# EAGLE design Breakout-01 (EAGLE 6.2)
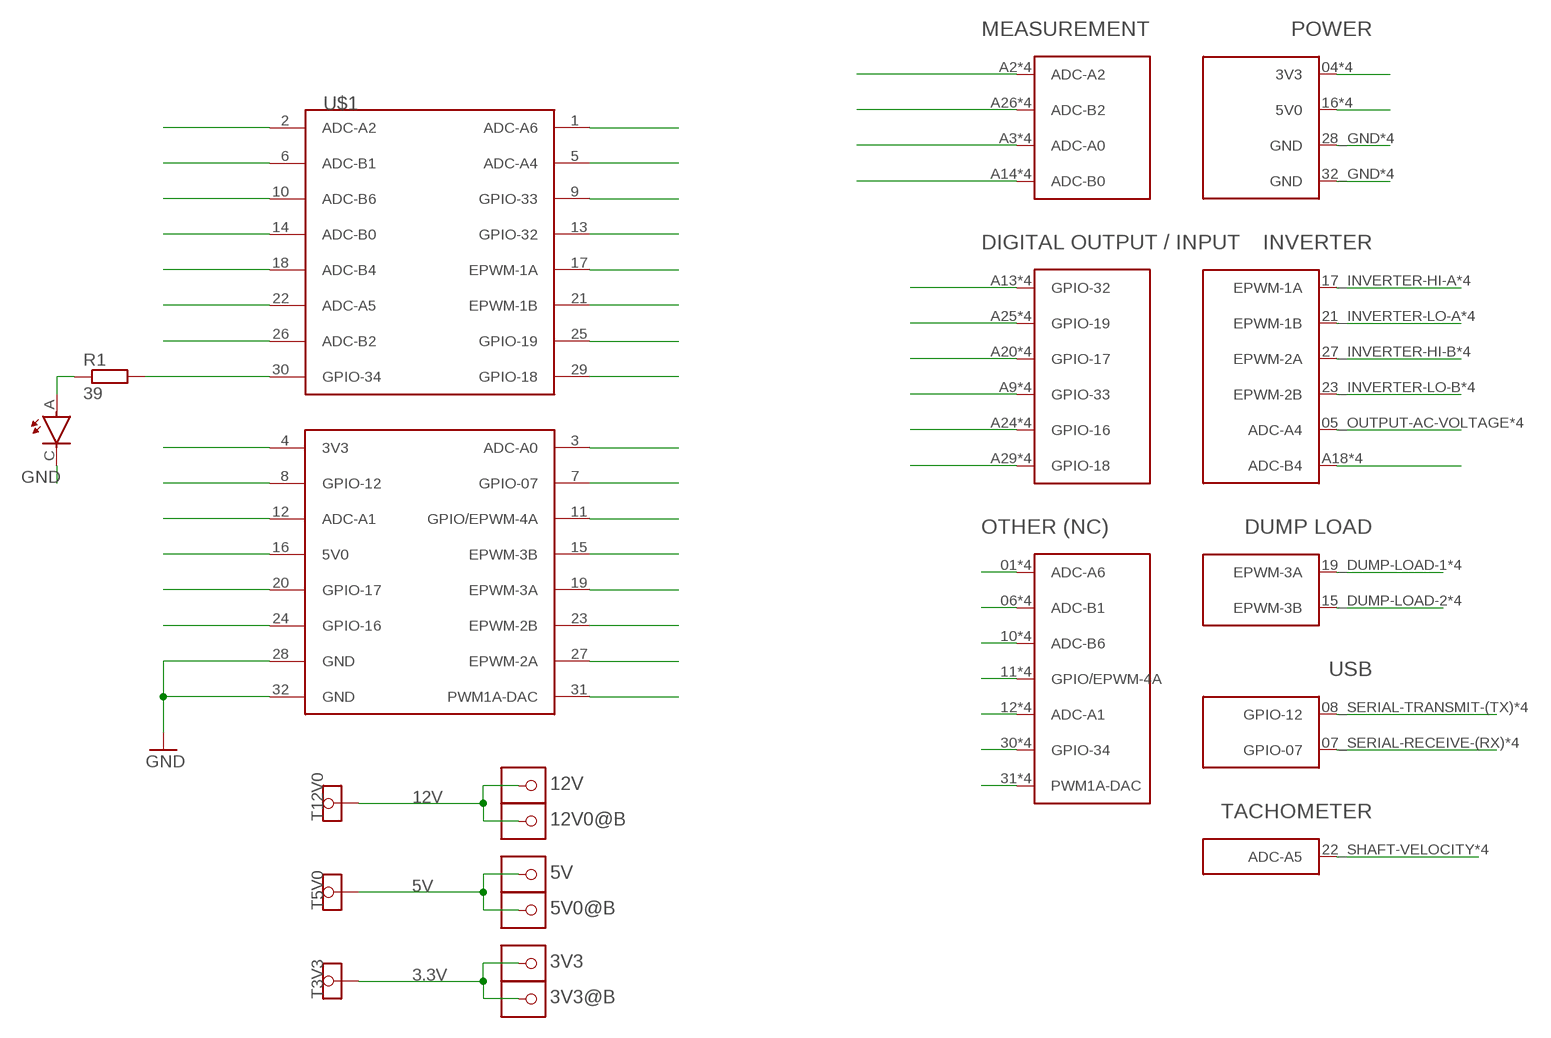
[diagram p0: schematic, sheet 1]

## Parts
3V3  1X1STACK  [1X1STACK]
3V3@B  1X1STACK  [1X1STACK]
5V  1X1STACK  [1X1STACK]
5V0@B  1X1STACK  [1X1STACK]
12V  1X1STACK  [1X1STACK]
12V0@B  1X1STACK  [1X1STACK]
GPIO34  PLCC2  [PLCC2]
R1  39  R-EU_R0805  [R0805]
T3V3  TESTPAD  [TESTPAD]
T5V0  TESTPAD  [TESTPAD]
T12V0  TESTPAD  [TESTPAD]
U$1  CONTROLLER_SOCKET  [CONTROLLER_SOCKET]
U$2  CONTROLLER_STACK  [CONTROLLER_STACK]

## Nets
3.3V: 3V3.P$2 3V3.P$5 3V3.P$58 3V3.P$65 3V3.PAD 3V3@B.P$2 3V3@B.P$5 3V3@B.P$58 3V3@B.P$65 3V3@B.PAD T3V3.TP
3V3: U$1.4(3V3) U$2.04(3V3) U$2.A4(3V3) U$2.B4(3V3) U$2.C4(3V3)
5V: 5V0@B.P$2 5V0@B.P$5 5V0@B.P$58 5V0@B.P$65 5V0@B.PAD 5V.P$2 5V.P$5 5V.P$58 5V.P$65 5V.PAD T5V0.TP
5V0: U$1.16(5V0) U$2.16(5V0) U$2.A16(5V0) U$2.B16(5V0) U$2.C16(5V0)
12V: 12V0@B.P$2 12V0@B.P$5 12V0@B.P$58 12V0@B.P$65 12V0@B.PAD 12V.P$2 12V.P$5 12V.P$58 12V.P$65 12V.PAD T12V0.TP
ADCA0: U$1.3(ADC-A0) U$2.A3(ADC-A0) U$2.B3(ADC-A0) U$2.C3(ADC-A0) U$2.INPUT-AC-VOLTAGE_03(ADC-A0)
ADCA1: U$1.12(ADC-A1) U$2.12(ADC-A1) U$2.A12(ADC-A1) U$2.B12(ADC-A1) U$2.C12(ADC-A1)
ADCA2: U$1.2(ADC-A2) U$2.A2(ADC-A2) U$2.B2(ADC-A2) U$2.C2(ADC-A2) U$2.DC-BRIDGE-CURRENT_02(ADC-A2)
ADCA4: U$1.5(ADC-A4) U$2.05_OUTPUT-AC-VOLTAGE(ADC-A4) U$2.A5(ADC-A4) U$2.B5(ADC-A4) U$2.C5(ADC-A4)
ADCA5: U$1.22(ADC-A5) U$2.22_SHAFT-VELOCITY(ADC-A5) U$2.A22(ADC-A5) U$2.B22(ADC-A5) U$2.C22(ADC-A5)
ADCA6: U$1.1(ADC-A6) U$2.01(ADC-A6) U$2.A1(ADC-A6) U$2.B1(ADC-A6) U$2.C1(ADC-A6)
ADCB0: U$1.14(ADC-B0) U$2.A14(ADC-B0) U$2.AC-INPUT-CURRENT_14(ADC-B0) U$2.B14(ADC-B0) U$2.C14(ADC-B0)
ADCB1: U$1.6(ADC-B1) U$2.06(ADC-B1) U$2.A6(ADC-B1) U$2.B6(ADC-B1) U$2.C6(ADC-B1)
ADCB2: U$1.26(ADC-B2) U$2.A26(ADC-B2) U$2.B26(ADC-B2) U$2.C26(ADC-B2) U$2.DC-BRIDGE-VOLTAGE_26(ADC-B2)
ADCB4: U$1.18(ADC-B4) U$2.A18(ADC-B4) U$2.AC-OUTPUT-CURRENT_18(ADC-B4) U$2.B18(ADC-B4) U$2.C18(ADC-B4)
ADCB6: U$1.10(ADC-B6) U$2.10(ADC-B6) U$2.A10(ADC-B6) U$2.B10(ADC-B6) U$2.C10(ADC-B6)
EPWM1A: U$1.17(EPWM-1A) U$2.17_INVERTER-HI-A(EPWM-1A) U$2.A17(EPWM-1A) U$2.B17(EPWM-1A) U$2.C17(EPWM-1A)
EPWM1B: U$1.21(EPWM-1B) U$2.21_INVERTER-LO-A(EPWM-1B) U$2.A21(EPWM-1B) U$2.B21(EPWM-1B) U$2.C21(EPWM-1B)
EPWM2A: U$1.27(EPWM-2A) U$2.27_INVERTER-HI-B(EPWM-2A) U$2.A27(EPWM-2A) U$2.B27(EPWM-2A) U$2.C27(EPWM-2A)
EPWM2B: U$1.23(EPWM-2B) U$2.23_INVERTER-LO-B(EPWM-2B) U$2.A23(EPWM-2B) U$2.B23(EPWM-2B) U$2.C23(EPWM-2B)
EPWM3A: U$1.19(EPWM-3A) U$2.19_DUMP-LOAD-1(EPWM-3A) U$2.A19(EPWM-3A) U$2.B19(EPWM-3A) U$2.C19(EPWM-3A)
EPWM3B: U$1.15(EPWM-3B) U$2.15_DUMP-LOAD-2(EPWM-3B) U$2.A15(EPWM-3B) U$2.B15(EPWM-3B) U$2.C15(EPWM-3B)
EPWM4A: U$1.11(GPIO/EPWM-4A) U$2.11(GPIO/EPWM-4A) U$2.A11(GPIO/EPWM-4A) U$2.B11(GPIO/EPWM-4A) U$2.C11(GPIO/EPWM-4A)
GND: GPIO34.C U$1.28(GND) U$1.32(GND) U$2.28_GND(GND) U$2.32_GND(GND) U$2.A28(GND) U$2.A32(GND) U$2.B28(GND) U$2.B32(GND) U$2.C28(GND) U$2.C32(GND)
GPIO07: U$1.7(GPIO-07) U$2.07_SERIAL-RECEIVE-(RX)(GPIO-07) U$2.A7(GPIO-07) U$2.B7(GPIO-07) U$2.C7(GPIO-07)
GPIO12: U$1.8(GPIO-12) U$2.08_SERIAL-TRANSMIT-(TX)(GPIO-12) U$2.A8(GPIO-12) U$2.B8(GPIO-12) U$2.C8(GPIO-12)
GPIO16: U$1.24(GPIO-16) U$2.A24(GPIO-16) U$2.B24(GPIO-16) U$2.C24(GPIO-16) U$2.DATA-IN_24(GPIO-16)
GPIO17: U$1.20(GPIO-17) U$2.A20(GPIO-17) U$2.B20(GPIO-17) U$2.C20(GPIO-17) U$2.DATA-OUT_20(GPIO-17)
GPIO18: U$1.29(GPIO-18) U$2.A29(GPIO-18) U$2.B29(GPIO-18) U$2.C29(GPIO-18) U$2.LOAD_29(GPIO-18)
GPIO19: U$1.25(GPIO-19) U$2.A25(GPIO-19) U$2.B25(GPIO-19) U$2.C25(GPIO-19) U$2.CLOCK-OUT-2_25(GPIO-19)
GPIO32: U$1.13(GPIO-32) U$2.A13(GPIO-32) U$2.B13(GPIO-32) U$2.C13(GPIO-32) U$2.CLOCK-OUT-1_13(GPIO-32)
GPIO33: U$1.9(GPIO-33) U$2.A9(GPIO-33) U$2.B9(GPIO-33) U$2.C9(GPIO-33) U$2.CLOCK_09(GPIO-33)
GPIO34: R1.2 U$1.30(GPIO-34) U$2.30(GPIO-34) U$2.A30(GPIO-34) U$2.B30(GPIO-34) U$2.C30(GPIO-34)
N$2: GPIO34.A R1.1
PWM1ADAC: U$1.31(PWM1A-DAC) U$2.31(PWM1A-DAC) U$2.A31(PWM1A-DAC) U$2.B31(PWM1A-DAC) U$2.C31(PWM1A-DAC)

## Library data of the parts
3V3 3V3@B 5V 5V0@B 12V 12V0@B = headers v6-2:1X1STACK
GPIO34 = PCB_ControlStack:PLCC2
R1 = resistor:R-EU_: RESISTOR, European symbol
T3V3 T5V0 T12V0 = PCB_ControlStack:TESTPAD
U$1 = PCB_ControlStack:CONTROLLER_SOCKET
U$2 = PCB_ControlStack:CONTROLLER_STACK

## Board
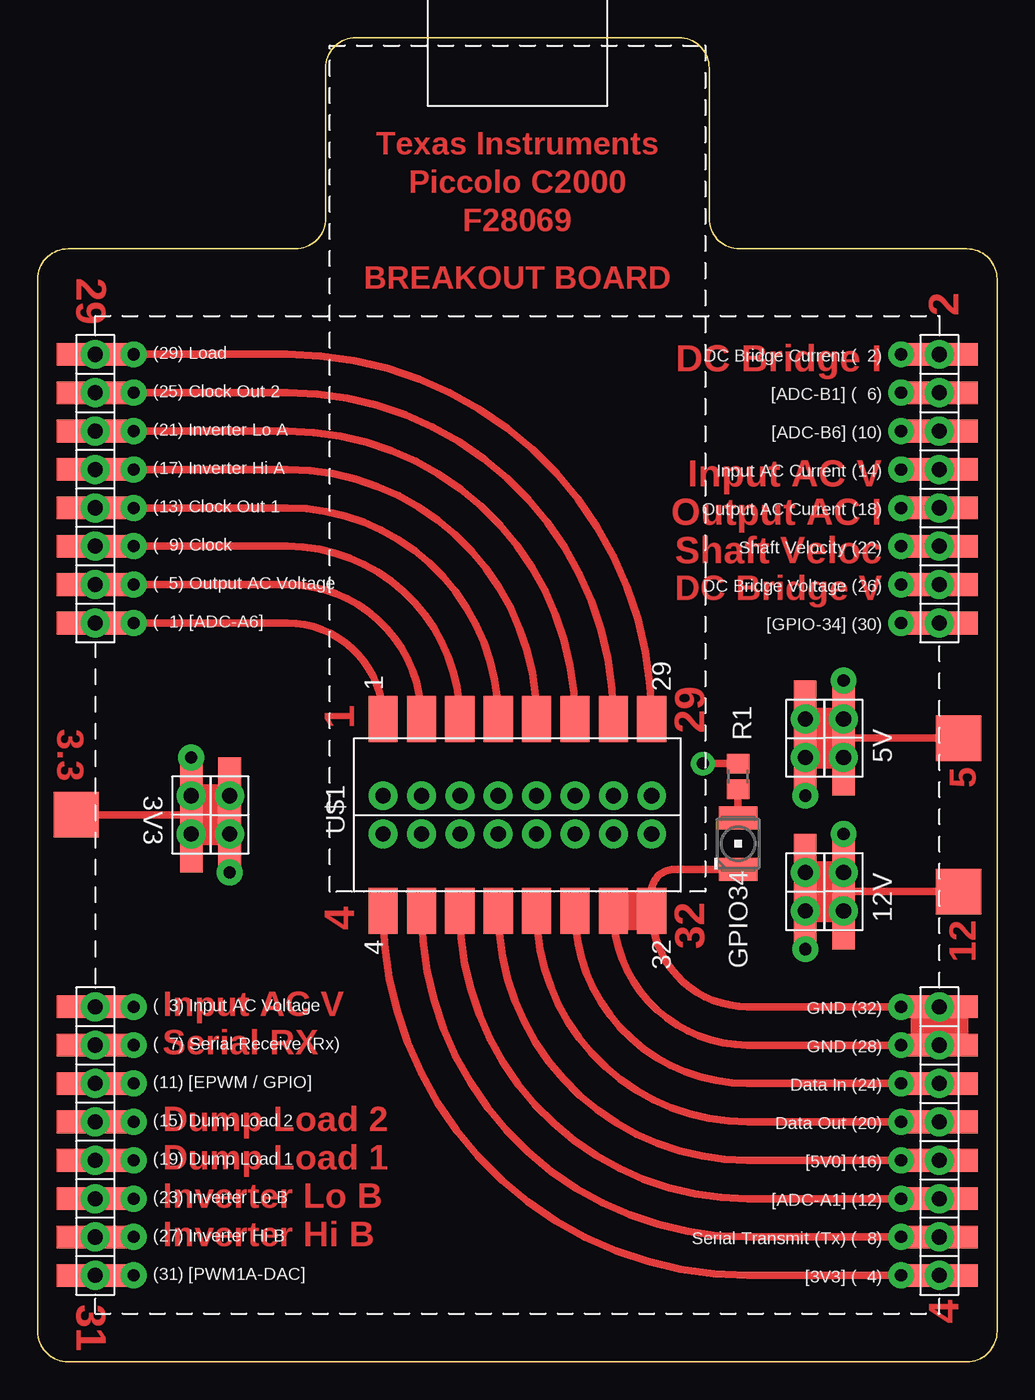
[diagram p1: board, top side]
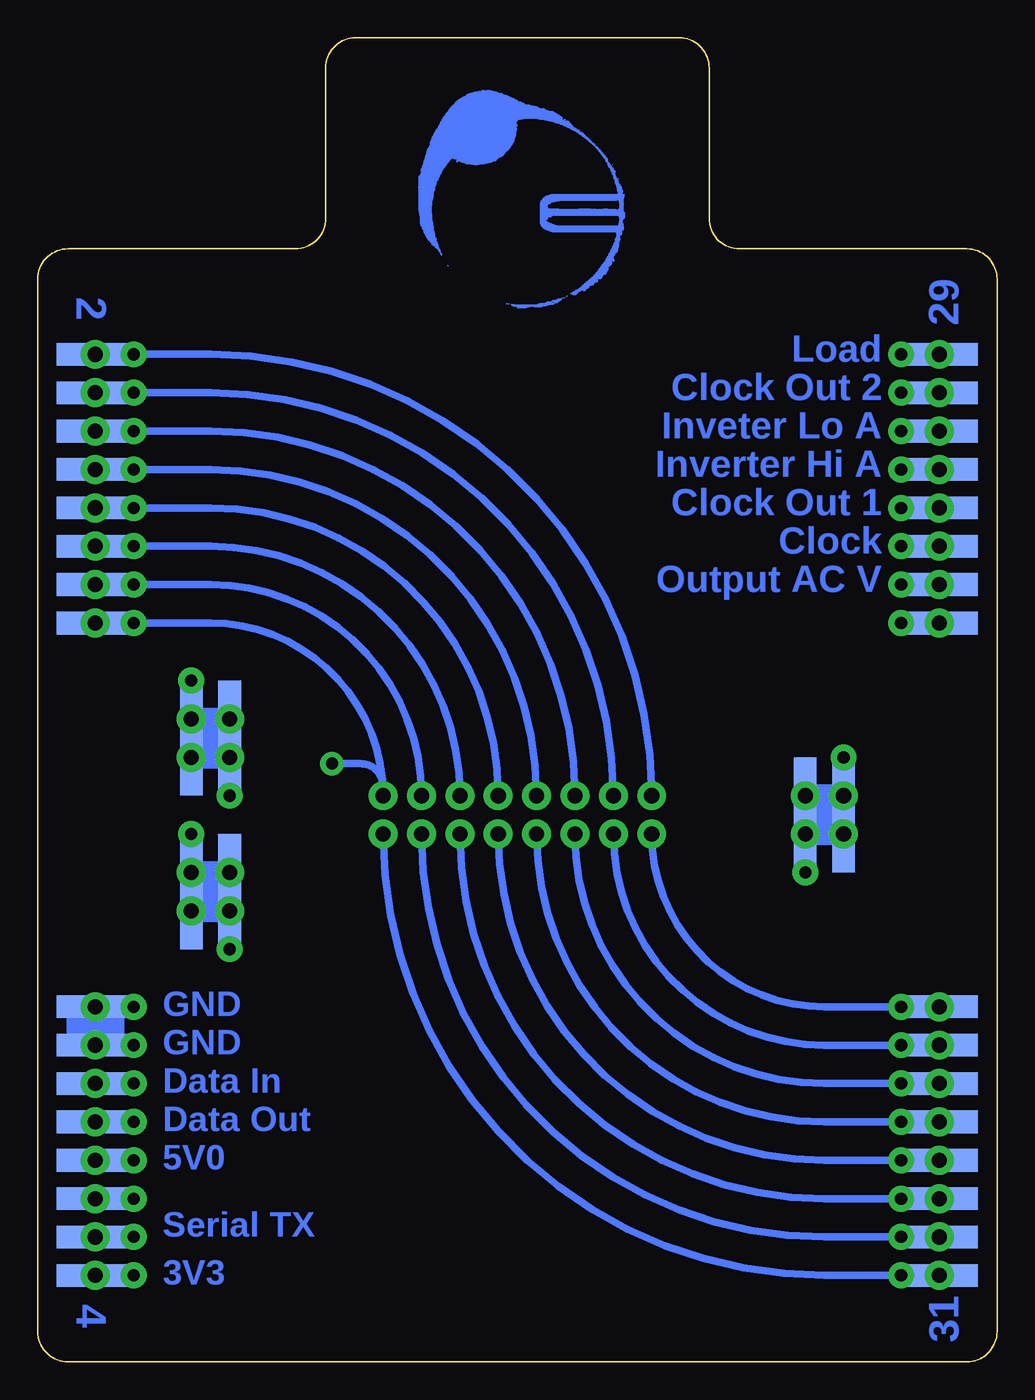
[diagram p2: board, bottom side, seen from below]

Size 63.5 x 87.63 mm. Coordinates in mm from the lower left corner, seen from the top.
Outline: 19.05,75.66 arc-90 17.05,73.66 2,73.66 arc90 0,71.66 0,2 arc90 2,0 61.5,0 arc90 63.5,2 63.5,71.66 arc90 61.5,73.66 46.45,73.66 arc-90 44.45,75.66
Outline: 44.45,75.56 44.45,85.63 arc90 42.45,87.63 21.05,87.63 arc90 19.05,85.63 19.05,75.56
Copper layers (1*16): Top 0.035mm / dielectric 1.5mm / Bottom 0.035mm
Design rules: minimum track width 12mil, minimum drill 0.7mm, track to track 25mil, track to pad 20mil, pad to pad 15mil, via to via 20mil, smd to smd 0mil, copper to edge 40mil, drill to drill 10mil, minimum pad ring 18mil, minimum via ring 15mil, stop-mask expansion 0mil, vias tented up to drill 0mil, thermal gap 15mil
tRestrict: 16 lines
bRestrict: 16 lines

### Footprints (pad centres in the part's own frame; a part is rotated, then mirrored left to right if it is on the bottom)
1X1STACK = drill 1: P$2 -1.27,0; PAD 1.27,0 | drill 0.8: P$5 3.81,0 | smd 7.62 x 1.5 bottom: P$58 0,0 | smd 7.62 x 1.5: P$65 0,0
PLCC2 = smd 2.54 x 1.524: A 0,1.702; C 0,-1.702
R0805 = smd 1.3 x 1.5: 1 -0.85,0; 2 0.85,0
TESTPAD = smd 3 x 3: TP 0,0
CONTROLLER_SOCKET = smd 3.048 x 1.93: 1 6.35,8.89; 4 -6.35,8.89; 5 6.35,6.35; 8 -6.35,6.35; 9 6.35,3.81; 12 -6.35,3.81; 13 6.35,1.27; 16 -6.35,1.27; 17 6.35,-1.27; 20 -6.35,-1.27; 21 6.35,-3.81; 24 -6.35,-3.81; 25 6.35,-6.35; 28 -6.35,-6.35; 29 6.35,-8.89; 32 -6.35,-8.89 | drill 1: 2 1.27,8.89; 3 -1.27,8.89; 6 1.27,6.35; 7 -1.27,6.35; 10 1.27,3.81; 11 -1.27,3.81; 14 1.27,1.27; 15 -1.27,1.27; 18 1.27,-1.27; 19 -1.27,-1.27; 22 1.27,-3.81; 23 -1.27,-3.81; 26 1.27,-6.35; 27 -1.27,-6.35; 30 1.27,-8.89; 31 -1.27,-8.89
CONTROLLER_STACK = drill 1: 01 -27.94,12.7; 04 27.94,-30.48; 05_OUTPUT-AC-VOLTAGE -27.94,15.24; 06 27.94,27.94; 07_SERIAL-RECEIVE-(RX) -27.94,-15.24; 08_SERIAL-TRANSMIT-(TX) 27.94,-27.94; 10 27.94,25.4; 11 -27.94,-17.78; 12 27.94,-25.4; 15_DUMP-LOAD-2 -27.94,-20.32; 16 27.94,-22.86; 17_INVERTER-HI-A -27.94,22.86; 19_DUMP-LOAD-1 -27.94,-22.86; 21_INVERTER-LO-A -27.94,25.4; 22_SHAFT-VELOCITY 27.94,17.78; 23_INVERTER-LO-B -27.94,-25.4; 27_INVERTER-HI-B -27.94,-27.94; 28_GND 27.94,-15.24; 30 27.94,12.7; 31 -27.94,-30.48; 32_GND 27.94,-12.7; AC-INPUT-CURRENT_14 27.94,22.86; AC-OUTPUT-CURRENT_18 27.94,20.32; CLOCK-OUT-1_13 -27.94,20.32; CLOCK-OUT-2_25 -27.94,27.94; CLOCK_09 -27.94,17.78; DATA-IN_24 27.94,-17.78; DATA-OUT_20 27.94,-20.32; DC-BRIDGE-CURRENT_02 27.94,30.48; DC-BRIDGE-VOLTAGE_26 27.94,15.24; INPUT-AC-VOLTAGE_03 -27.94,-12.7; LOAD_29 -27.94,30.48 | smd 5.08 x 1.5: A1 -27.94,12.7; A2 27.94,30.48; A3 -27.94,-12.7; A4 27.94,-30.48; A5 -27.94,15.24; A6 27.94,27.94; A7 -27.94,-15.24; A8 27.94,-27.94; A9 -27.94,17.78; A10 27.94,25.4; A11 -27.94,-17.78; A12 27.94,-25.4; A13 -27.94,20.32; A14 27.94,22.86; A15 -27.94,-20.32; A16 27.94,-22.86; A17 -27.94,22.86; A18 27.94,20.32; A19 -27.94,-22.86; A20 27.94,-20.32; A21 -27.94,25.4; A22 27.94,17.78; A23 -27.94,-25.4; A24 27.94,-17.78; A25 -27.94,27.94; A26 27.94,15.24; A27 -27.94,-27.94; A28 27.94,-15.24; A29 -27.94,30.48; A30 27.94,12.7; A31 -27.94,-30.48; A32 27.94,-12.7 | smd 5.08 x 1.5 bottom: B1 -27.94,12.7; B2 27.94,30.48; B3 -27.94,-12.7; B4 27.94,-30.48; B5 -27.94,15.24; B6 27.94,27.94; B7 -27.94,-15.24; B8 27.94,-27.94; B9 -27.94,17.78; B10 27.94,25.4; B11 -27.94,-17.78; B12 27.94,-25.4; B13 -27.94,20.32; B14 27.94,22.86; B15 -27.94,-20.32; B16 27.94,-22.86; B17 -27.94,22.86; B18 27.94,20.32; B19 -27.94,-22.86; B20 27.94,-20.32; B21 -27.94,25.4; B22 27.94,17.78; B23 -27.94,-25.4; B24 27.94,-17.78; B25 -27.94,27.94; B26 27.94,15.24; B27 -27.94,-27.94; B28 27.94,-15.24; B29 -27.94,30.48; B30 27.94,12.7; B31 -27.94,-30.48; B32 27.94,-12.7 | drill 0.8: C1 -25.4,12.7; C2 25.4,30.48; C3 -25.4,-12.7; C4 25.4,-30.48; C5 -25.4,15.24; C6 25.4,27.94; C7 -25.4,-15.24; C8 25.4,-27.94; C9 -25.4,17.78; C10 25.4,25.4; C11 -25.4,-17.78; C12 25.4,-25.4; C13 -25.4,20.32; C14 25.4,22.86; C15 -25.4,-20.32; C16 25.4,-22.86; C17 -25.4,22.86; C18 25.4,20.32; C19 -25.4,-22.86; C20 25.4,-20.32; C21 -25.4,25.4; C22 25.4,17.78; C23 -25.4,-25.4; C24 25.4,-17.78; C25 -25.4,27.94; C26 25.4,15.24; C27 -25.4,-27.94; C28 25.4,-15.24; C29 -25.4,30.48; C30 25.4,12.7; C31 -25.4,-30.48; C32 25.4,-12.7

### Placement (x,y rotation side)
3V3  12.7,36.2 270 top
3V3@B  10.16,36.2 90 top
5V  50.8,41.27 270 top
5V0@B  53.34,41.27 90 top
12V  50.8,31.11 270 top
12V0@B  53.34,31.11 90 top
GPIO34  46.35,34.29 0 top
R1  46.35,38.73 90 top
T3V3  2.54,36.2 90 top
T5V0  60.96,41.27 270 top
T12V0  60.96,31.11 270 top
U$1  31.75,36.2 90 top
U$2  31.75,36.2 0 top

### Tracks (layer width: path | path; a pad name or v marks a point on that pad's centre or on a via)
3.3V
  Top 0.5: 3V3.P$58 T3V3.TP
  Top 1.5: 3V3@B.PAD 3V3@B.P$5 | 3V3.PAD 3V3.P$5 | 3V3@B.P$58 3V3@B.PAD | 3V3@B.PAD 3V3.P$2 3V3.P$58 3V3.PAD | 3V3@B.P$2 3V3.PAD
  Bottom 1.5: 3V3@B.P$58 3V3@B.PAD | 3V3@B.PAD 3V3@B.P$5 | 3V3.P$58 3V3.PAD | 3V3.PAD 3V3.P$5 | 3V3.PAD 3V3@B.P$2 3V3@B.PAD | 3V3.P$2 3V3@B.PAD
3V3
  Top 0.5: U$2.B4 U$2.C4 46.99,5.71 arc-90 U$1.4
5V
  Top 0.5: T5V0.TP 5V.P$58
  Top 1.5: 5V.P$58 5V.PAD | 5V.PAD 5V.P$5 | 5V0@B.P$58 5V0@B.PAD | 5V0@B.PAD 5V0@B.P$5 | 5V0@B.PAD 5V.P$2 | 5V0@B.P$2 5V.PAD
  Bottom 1.5: 5V.P$58 5V.P$5 | 5V0@B.PAD 5V0@B.P$5 | 5V0@B.P$2 5V.PAD 5V.P$2 5V0@B.PAD | 5V0@B.P$58 5V0@B.PAD
5V0
  Top 0.5: U$2.B16 U$2.C16 46.99,13.34 arc-90 U$1.16
12V
  Top 0.5: 12V.P$58 T12V0.TP
  Top 1.5: 12V0@B.PAD 12V0@B.P$5 | 12V.P$58 12V.P$5 | 12V0@B.P$2 12V.PAD 12V.P$58 | 12V0@B.P$58 12V0@B.PAD | 12V0@B.PAD 12V.P$2 12V.P$58
  Bottom 1.5: 12V0@B.P$58 12V0@B.PAD | 12V0@B.PAD 12V0@B.P$5 | 12V.P$58 12V.PAD | 12V.PAD 12V.P$5 | 12V0@B.P$2 12V.PAD | 12V.P$2 12V0@B.PAD
ADCA0
  Bottom 0.5: U$2.B3 U$2.C3 11.43,23.5 arc90 U$1.3
ADCA1
  Top 0.5: U$2.B12 U$2.C12 46.99,10.79 arc-90 U$1.12
ADCA2
  Bottom 0.5: U$2.B2 U$2.C2 52.07,66.67 arc90 U$1.2
ADCA4
  Top 0.5: U$2.B5 U$2.C5 16.51,51.44 arc-90 U$1.5
ADCA5
  Bottom 0.5: U$2.B22 U$2.C22 52.07,53.98 arc90 U$1.22
ADCA6
  Top 0.5: U$2.B1 U$2.C1 16.51,48.9 arc-90 U$1.1
ADCB0
  Bottom 0.5: U$2.B14 U$2.C14 52.07,59.05 arc90 U$1.14
ADCB1
  Bottom 0.5: U$2.B6 U$2.C6 52.07,64.14 arc90 U$1.6
ADCB2
  Bottom 0.5: U$2.B26 U$2.C26 52.07,51.44 arc90 U$1.26
ADCB4
  Bottom 0.5: U$2.B18 U$2.C18 52.07,56.52 arc90 U$1.18
ADCB6
  Bottom 0.5: U$2.B10 U$2.C10 52.07,61.59 arc90 U$1.10
EPWM1A
  Top 0.5: U$2.B17 U$2.C17 16.51,59.05 arc-90 U$1.17
EPWM1B
  Top 0.5: U$2.B21 U$2.C21 16.51,61.59 arc-90 U$1.21
EPWM2A
  Bottom 0.5: U$2.B27 U$2.C27 11.43,8.26 arc90 U$1.27
EPWM2B
  Bottom 0.5: U$2.B23 U$2.C23 11.43,10.79 arc90 U$1.23
EPWM3A
  Bottom 0.5: U$2.B19 U$2.C19 11.43,13.34 arc90 U$1.19
EPWM3B
  Bottom 0.5: U$2.B15 U$2.C15 11.43,15.88 arc90 U$1.15
EPWM4A
  Bottom 0.5: U$2.B11 U$2.C11 11.43,18.41 arc90 U$1.11
GND
  Top 0.5: U$1.32 arc90 46.99,23.5 U$2.C32 U$2.B32 U$2.B28 U$2.C28 46.99,20.95 arc-90 U$1.28 U$1.32 | GPIO34.C 42.11,32.59 arc90 40.64,31.11 U$1.32
GPIO07
  Bottom 0.5: U$2.B7 U$2.C7 11.43,20.95 arc90 U$1.7
GPIO12
  Top 0.5: U$2.B8 U$2.C8 46.99,8.26 arc-90 U$1.8
GPIO16
  Top 0.5: U$2.B24 U$2.C24 46.99,18.41 arc-90 U$1.24
GPIO17
  Top 0.5: U$2.B20 U$2.C20 46.99,15.88 arc-90 U$1.20
GPIO18
  Top 0.5: U$2.B29 U$2.C29 16.51,66.67 arc-90 U$1.29
GPIO19
  Top 0.5: U$2.B25 U$2.C25 16.51,64.14 arc-90 U$1.25
GPIO32
  Top 0.5: U$2.B13 U$2.C13 16.51,56.52 arc-90 U$1.13
GPIO33
  Top 0.5: U$2.B9 U$2.C9 16.51,53.98 arc-90 U$1.9
GPIO34  (via drill 0.8)
  Top 0.5: R1.2 v44.03,39.59
  Bottom 0.5: U$2.B30 U$2.C30 52.07,48.9 arc90 U$1.30 40.64,38.1 arc-90 42.12,39.59 v44.03,39.59
N$2
  Top 0.5: GPIO34.A R1.1
PWM1ADAC
  Bottom 0.5: U$2.B31 U$2.C31 11.43,5.71 arc90 U$1.31
(copper drawn outside any net)
  shapes: Bottom area x1038, Top area x5

### Text on the board
Top: Texas Instruments | Piccolo C2000 | F28069 | 29 | BREAKOUT BOARD | 2 | DC Bridge I | Input AC V | Output AC I | Shaft Veloc | DC Bridge V | 3.3 | 1 | 29 | 5 | 4 | 12 | 32 | Input AC V | Serial RX | Dump Load 2 | Dump Load 1 | Inverter Lo B | Inverter Hi B | 31 | 4
Bottom: 2 | 29 | Load | Clock Out 2 | Inveter Lo A | Inverter Hi A | Clock Out 1 | Clock | Output AC V | GND | GND | Data In | Data Out | 5V0 | Serial TX | 3V3 | 4 | 31